# EAGLE design sensor (EAGLE 9.6.1)
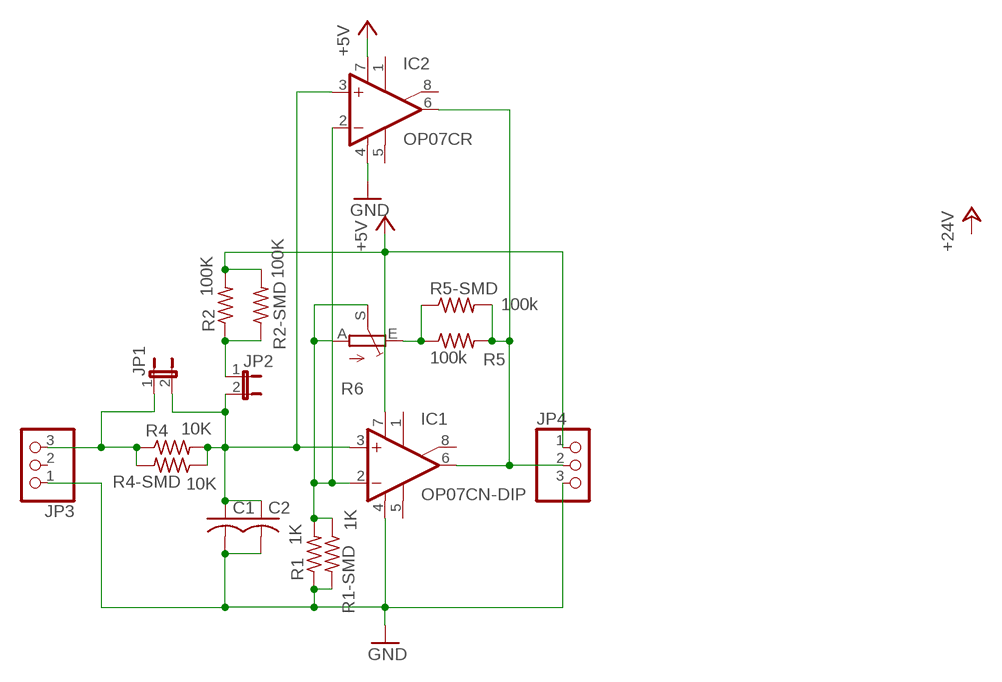
[diagram p0: schematic, sheet 1]

## Parts
C1  C-US025-030X050  [C025-030X050]
C2  C-USC0805  [C0805]
IC1  OP07CN-DIP  OP07CN  [DIL08]
IC2  OP07CR  [SO08]
JP1  JP1E  [JP1]
JP2  JP1E  [JP1]
JP3  PINHD-1X3  [1X03]
JP4  PINHD-1X3  [1X03]
R1  1K  R-US_0204/5  [0204/5]
R1-SMD  1K  R-US_R0805  [R0805]
R2  100K  R-US_0204/5  [0204/5]
R2-SMD  100K  R-US_R0805  [R0805]
R4  10K  R-US_0204/5  [0204/5]
R4-SMD  10K  R-US_R0805  [R0805]
R5  100k  R-US_0204/5  [0204/5]
R5-SMD  100k  R-US_R0805  [R0805]
R6  TRIM_EU-B64Y  [B64Y]

## Nets
+5V: IC1.7(V+) IC2.7(V+) JP4.1 R2-SMD.2 R2.2
GND: C1.2 C2.2 IC1.4(V-) IC2.4(V-) JP3.1 JP4.3 R1-SMD.2 R1.1
N$1: IC1.2(-IN) IC2.2(-IN) R1-SMD.1 R1.2 R6.A R6.S
N$2: C1.1 C2.1 IC1.3(+IN) IC2.3(+IN) JP1.2 JP2.2 R4-SMD.1 R4.2
N$4: JP1.1 JP3.3 R4-SMD.2 R4.1
N$5: JP2.1 R2-SMD.1 R2.1
N$6: R5-SMD.1 R5.1 R6.E
N$8: IC1.6(OUT) IC2.6(OUT) JP4.2 R5-SMD.2 R5.2
Unconnected: IC1.1(ON1) IC1.5(OPT) IC1.8(ON2) IC2.1(ON1) IC2.5(OPT) IC2.8(ON2) JP3.2

## Library data of the parts
C1 C2 = rcl:C-US: CAPACITOR, American symbol; SPICEPREFIX: C
IC1 IC2 = linear:OP07*: OP AMP
JP1 JP2 = jumper:JP1E: JUMPER
JP3 JP4 = pinhead:PINHD-1X3: PIN HEADER
R1 R1-SMD R2 R2-SMD R4 R4-SMD R5 R5-SMD = rcl:R-US_: RESISTOR, American symbol; SPICEPREFIX: R
R6 = pot:TRIM_EU-: POTENTIOMETER

## Board
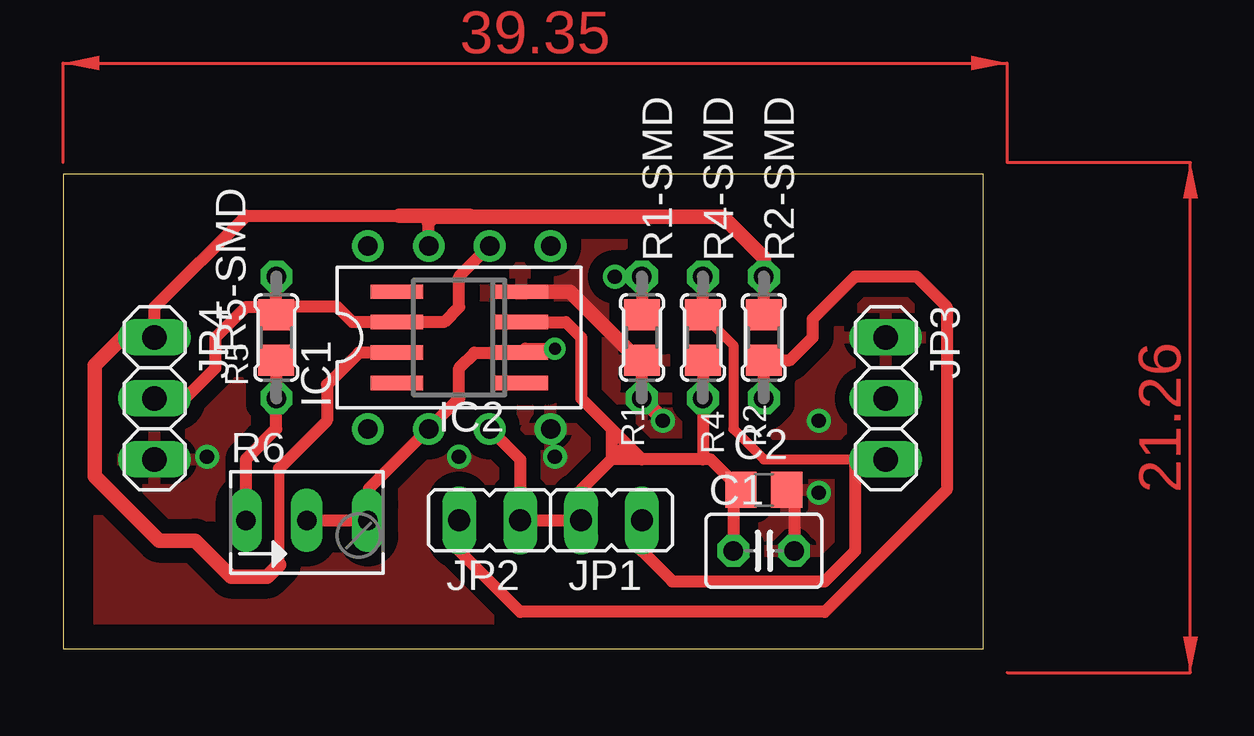
[diagram p1: board, top side]
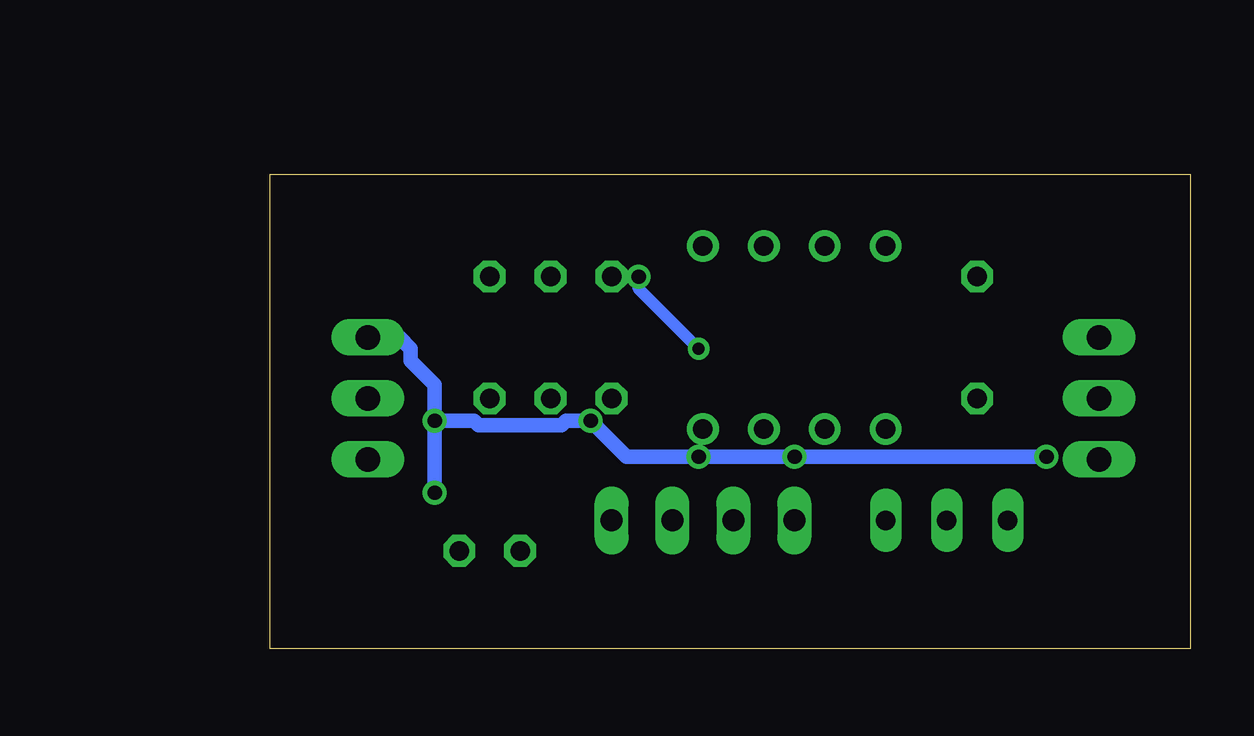
[diagram p2: board, bottom side, seen from below]

Size 38.35 x 19.76 mm. Coordinates in mm from the lower left corner, seen from the top.
Outline: 0,0 38.35,0 38.35,19.76 0,19.76 0,0
Copper layers (1*16): Top 0.035mm / dielectric 1.5mm / Bottom 0.035mm
Design rules "default": minimum track width 6mil, minimum drill 0.35mm, track to track 6mil, track to pad 6mil, pad to pad 6mil, via to via 6mil, smd to smd 6mil, copper to edge 40mil, drill to drill 6mil, minimum pad ring 10mil, minimum via ring 8mil, stop-mask expansion 4mil, vias tented up to drill 0mil, thermal gap 10mil

### Footprints (pad centres in the part's own frame; a part is rotated, then mirrored left to right if it is on the bottom)
C025-030X050 = drill 0.813 octagon: 1 -1.27,0; 2 1.27,0
C0805 = smd 1.3 x 1.5: 1 -0.95,0; 2 0.95,0
DIL08 = drill 0.813 pad 1.27: 1 -3.81,-3.81; 2 -1.27,-3.81; 3 1.27,-3.81; 4 3.81,-3.81; 5 3.81,3.81; 6 1.27,3.81; 7 -1.27,3.81; 8 -3.81,3.81
SO08 = smd 0.6 x 2.2: 1 -1.905,-2.6; 2 -0.635,-2.6; 3 0.635,-2.6; 4 1.905,-2.6; 5 1.905,2.6; 6 0.635,2.6; 7 -0.635,2.6; 8 -1.905,2.6
JP1 = drill 0.914 long: 1 0,-1.27; 2 0,1.27
1X03 = drill 1.016 long: 1 -2.54,0; 2 0,0; 3 2.54,0
0204/5 = drill 0.813 octagon: 1 -2.54,0; 2 2.54,0
R0805 = smd 1.3 x 1.5: 1 -0.95,0; 2 0.95,0
B64Y = drill 0.813 long: A 2.54,0; E -2.54,0; S 0,0

### Placement (x,y rotation side)
C1  29.21,4.08 0 top
C2  29.21,6.62 0 top
IC1  16.51,12.97 0 top
IC2  16.51,12.97 90 top
JP1  22.86,5.35 90 top
JP2  17.78,5.35 270 top
JP3  34.29,10.43 270 top
JP4  3.81,10.43 270 top
R1  24.13,12.97 90 top
R1-SMD  24.13,12.97 270 top
R2  29.21,12.97 90 top
R2-SMD  29.21,12.97 90 top
R4  26.67,12.97 270 top
R4-SMD  26.67,12.97 90 top
R5  8.89,12.97 90 top
R5-SMD  8.89,12.97 90 top
R6  10.16,5.35 0 top

### Tracks (layer width: path | path; a pad name or v marks a point on that pad's centre or on a via)
+5V
  Top 0.406: 9,7.5 9,3.5
  Top 0.508: R2-SMD.2 R2.2 | JP4.1 3.81,14.24 7.62,18.05 14,18.05 14.97,18.05 15.24,17.78 IC1.7 | IC2.7 12.34,12.34 11,11 11,9.5 9,7.5
  Top 0.61: 9,3.5 8.5,3 7,3 5.5,4.5 4,4.5 1.32,7.18 1.32,11.82 2.5,13 2.53,12.97 JP4.1 | 15.24,17.78 15.46,18 17,18 | 17,18 27.5,18 29.21,16.29 R2.2 | 14,18.05 16.95,18.05 17,18
GND  (via drill 0.6)
  Top 0.508: R1.1 R1-SMD.2 | C2.2 30.48,6.3 C1.2
  Top 0.61: R1.1 25,9.56 v25,9.5 | R1-SMD.2 23.98,12.02 21.12,14.88 IC2.4
  Bottom 0.61: v6,8 v16.5,8 v20.5,8 23.5,8 v25,9.5 26.02,9.5 26.21,9.31 29.67,9.31 29.86,9.5 v31.5,9.5 | JP3.1 32.97,12.97 32.5,12.5 32.5,12 31.5,11 v31.5,9.5 | v31.5,6.5 v31.5,9.5
  pour Top (isolate 0.61): 1.5,19 1.5,0.5 38,0.5 38,19
N$1  (via drill 0.5, 0.6)
  Top 0.508: R1.2 R1-SMD.1 | R6.S R6.A 12.74,5.39 12.74,6.66 IC1.2 16.51,10.43 16.51,11.7 17.14,12.34 IC2.2 19.27,12.5 v20.5,12.5
  Bottom 0.508: R1.2 v23,15.5 23,15 v20.5,12.5
N$2
  Top 0.508: IC1.3 19.05,7.89 JP2.2 JP1.2 21.59,6.62 22.86,7.89 | R4-SMD.1 R4.2 26.67,7.89 | C1.1 27.94,6.3 C2.1 26.99,7.89 26.67,7.89 | 26.67,7.89 24.13,7.89 | 24.13,7.89 22.86,7.89 | IC2.3 20.95,13.61 21.59,12.97 21.59,10.43 22.86,9.16 | 22.86,9.16 22.86,7.89 | 24.13,7.89 23.5,8.53 | 23.5,8.53 22.86,9.16 | 22.86,7.89 23.5,8.53
N$4
  Top 0.406: R4-SMD.2 27.56,13.03 27.57,13.03 27.94,12.65 27.94,9.16 29.21,7.89 33.02,7.89 JP3.3
  Top 0.508: R4-SMD.2 R4.1 | JP1.1 24.13,4.08 25.4,2.81 31.75,2.81 33.02,4.08 33.02,7.89
N$5
  Top 0.508: R2.1 R2-SMD.1 30.3,12.02 31.25,12.97 31.25,13.74 33.02,15.51 35.56,15.51 36.83,14.24 36.83,6.62 31.75,1.54 19.05,1.54 16.51,4.08 JP2.1
N$6
  Top 0.508: R5-SMD.1 R5.1 8.89,9.16 7.62,7.89 R6.E
N$8
  Top 0.508: R5-SMD.2 R5.2 | JP4.2 5.08,10.43 6.35,11.7 6.35,12.97 7.62,14.24 8.57,14.24 R5-SMD.2 | R5-SMD.2 9.21,14.24 11.43,14.24 12.06,13.61 IC2.6 15.88,13.61 16.51,14.24 16.51,15.51 IC1.6
(copper drawn outside any net)
  shapes: Top area x2